# Altium project meteostancia_TX.PrjPcb
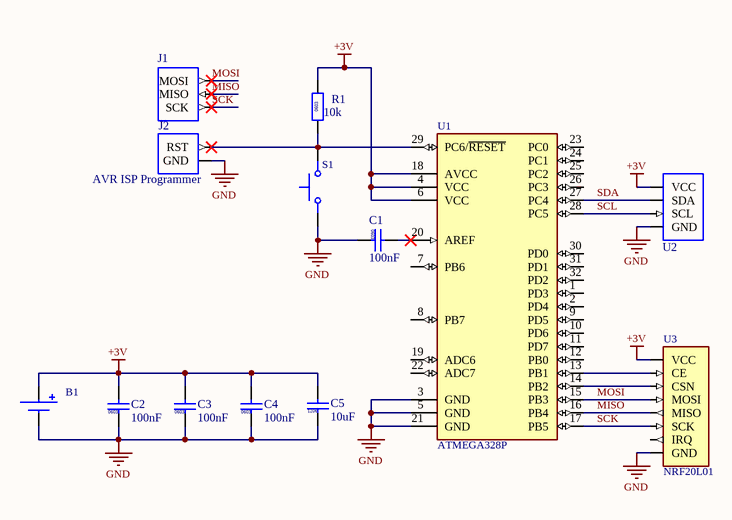
[diagram p0: meteostancia_TX.SchDoc]
1 sheet, 13 parts. Net scope: global (net labels, ports and power ports of the same name join across sheets).
Board file: meteostancia_TX.PcbDoc

## Sheet meteostancia_TX.SchDoc
size A4; SheetNumber: 1; SheetTotal: 1

### Parts
B1  Baterry  [CR123A]  (value not drawn)
C1  value 100nF  [CAPC1608-0603N]  (hidden comment: CAPC_0603)
C2  value 100nF  [CAPC1608-0603N]  (hidden comment: CAPC_0603)
C3  value 100nF  [CAPC1608-0603N]  (hidden comment: CAPC_0603)
C4  value 100nF  [CAPC1608-0603N]  (hidden comment: CAPC_0603)
C5  value 10uF  [CAPC3216-1206M]  (hidden comment: CAPC_1206)
J1  AVR ISP Programmer  [PLS-3]
J2  VR ISP Programmer2  [PLS-2]  (value not drawn)
R1  value 10k  [RESC1608-0603N]  (hidden comment: RESC_0603_R)
S1  Switch  [Switch arduino]  (value not drawn)
U1  ATMEGA328P  [Atmega328]
U2  BME280  [Quad20 - duplicate]  (value not drawn)
U3  NRF20L01  [NRF24L01]

### Nets
+3V: B1.1 C2.2 C3.2 C4.2 C5.2 R1.2 U1.4(VCC) U1.6(VCC) U1.18(AVCC) U2.1(VCC) U3.1(VCC)
GND: B1.2 C1.1 C2.1 C3.1 C4.1 C5.1 J2.2(GND) S1.1 U1.3(GND) U1.5(GND) U1.21(GND) U2.2(GND) U3.2(GND)
MISO: J1.2(MISO) U1.16(PB4) U3.7(MISO)
MOSI: J1.1(MOSI) U1.15(PB3) U3.6(MOSI)
SCK: J1.3(SCK) U1.17(PB5) U3.5(SCK)
SCL: U1.28(PC5) U2.3(SCL)
SDA: U1.27(PC4) U2.4(SDA)
NetC1_2: C1.2 U1.20(AREF)
NetJ2_1: J2.1(RST) R1.1 S1.2 U1.29(PC6/~{RESET})
NetU1_13: U1.13(PB1) U3.3(CE)
NetU1_14: U1.14(PB2) U3.4(CSN)

Not connected (* = marked no-connect by the designer): U1 1(PD3) 2(PD4) 7(PB6) 8(PB7) 9(PD5) 10(PD6) 11(PD7) 12(PB0) 19(ADC6) 22(ADC7) 23(PC0) 24(PC1) 25(PC2) 26(PC3) 30(PD0) 31(PD1) 32(PD2); U3 8(IRQ)

### Notes on the sheet
- (in symbol CAPC_0603) 0603
- (in symbol CAPC_1206) 1206
- (in symbol RESC_0603_R) 0603

### Library data of the parts
C1-C4 = CAPC_0603: Capacitor 0603
C5 = CAPC_1206: Capacitor 1206
J2 = AVR ISP Programmer2
R1 = RESC_0603_R: Resistor 0603
S1 = Switch: MP: TL1105AF160Q; Value: *; Package: None; Price: None; Availability: Unavailable
U1 = ATMEGA328P: AVR AVRÂ® ATmega Microcontroller IC 8-Bit 20MHz 32KB (16K x 16) FLASH 32-TQFP (7x7); MF: Microchip Technology / Atmel; MP: ATMEGA328P-AN; SnapEDA_Link: https://www.snapeda.com/parts/ATMEGA328P-AN/Microchip/view-part/?ref=snap; Package: TQFP-32 Microchip Technology / Atmel; Value: *; Check_prices: https://www.snapeda.com/parts/ATMEGA328P-AN/Microchip/view-part/?ref=eda